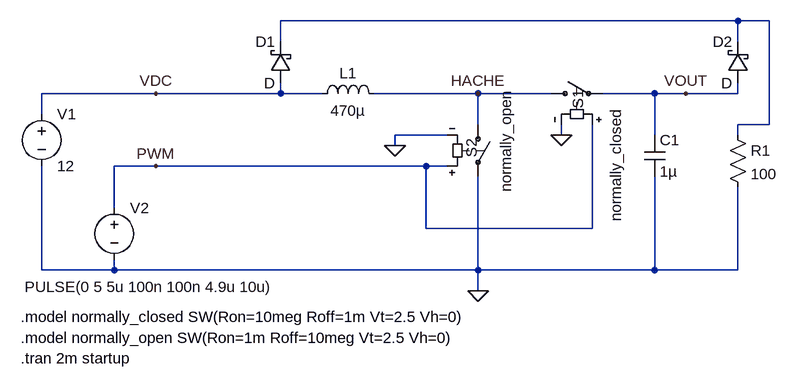
[diagram p0: schematic elevateur_parfait Diode schottky alims test 2.asc]
elevateur_parfait Diode schottky alims test 2.asc, the LTspice schematic file:
Version 4
SHEET 1 880 680
WIRE 416 0 -288 0
WIRE 464 0 416 0
WIRE -288 32 -288 0
WIRE 416 32 416 0
WIRE -480 112 -656 112
WIRE -288 112 -288 96
WIRE -288 112 -480 112
WIRE -224 112 -288 112
WIRE 16 112 -144 112
WIRE 128 112 16 112
WIRE 288 112 208 112
WIRE 336 112 288 112
WIRE 416 112 416 96
WIRE 416 112 336 112
WIRE -656 144 -656 112
WIRE 16 160 16 112
WIRE 464 160 464 0
WIRE 464 160 416 160
WIRE -32 176 -112 176
WIRE 144 176 144 160
WIRE 288 176 288 112
WIRE 416 176 416 160
WIRE -112 192 -112 176
WIRE -480 224 -544 224
WIRE -64 224 -480 224
WIRE -32 224 -64 224
WIRE -544 288 -544 224
WIRE -64 320 -64 224
WIRE 192 320 192 160
WIRE 192 320 -64 320
WIRE -656 384 -656 224
WIRE -544 384 -544 368
WIRE -544 384 -656 384
WIRE 16 384 16 240
WIRE 16 384 -544 384
WIRE 288 384 288 240
WIRE 288 384 16 384
WIRE 416 384 416 256
WIRE 416 384 288 384
WIRE 16 416 16 384
FLAG 16 416 0
FLAG -480 112 VDC
FLAG 336 112 VOUT
FLAG 16 112 HACHE
FLAG -480 224 PWM
FLAG -112 192 0
FLAG 144 176 0
SYMBOL ind -240 128 R270
WINDOW 0 32 56 VTop 2
WINDOW 3 5 56 VBottom 2
SYMATTR InstName L1
SYMATTR Value 470µ
SYMBOL res 400 160 R0
SYMATTR InstName R1
SYMATTR Value 100
SYMBOL cap 272 176 R0
SYMATTR InstName C1
SYMATTR Value 1µ
SYMBOL sw 112 112 R270
WINDOW 38 -197 116 Left 2
WINDOW 0 -23 58 Left 2
SYMATTR SpiceModel normally_closed
SYMATTR InstName S1
SYMATTR Value ""
SYMBOL sw 16 144 R0
WINDOW 38 43 -39 VRight 2
WINDOW 0 -10 67 VLeft 2
SYMATTR SpiceModel normally_open
SYMATTR InstName S2
SYMATTR Value ""
SYMBOL voltage -656 128 R0
WINDOW 123 0 0 Left 2
WINDOW 39 0 0 Left 2
SYMATTR InstName V1
SYMATTR Value 12
SYMBOL voltage -544 272 R0
WINDOW 3 -138 138 Left 2
WINDOW 123 0 0 Left 2
WINDOW 39 0 0 Left 2
SYMATTR Value PULSE(0 5 5u 100n 100n 4.9u 10u)
SYMATTR InstName V2
SYMBOL schottky -272 96 R180
WINDOW 0 24 64 Left 2
WINDOW 3 24 0 Left 2
SYMATTR InstName D1
SYMBOL schottky 432 96 R180
WINDOW 0 24 64 Left 2
WINDOW 3 24 0 Left 2
SYMATTR InstName D2
TEXT -688 456 Left 2 !.model normally_closed SW(Ron=10meg Roff=1m Vt=2.5 Vh=0)
TEXT -688 520 Left 2 !.tran 2m startup
TEXT -688 488 Left 2 !.model normally_open SW(Ron=1m Roff=10meg Vt=2.5 Vh=0)

The netlist it stands for:
* elevateur_parfait Diode schottky alims test 2.asc
L1 VDC HACHE 470µ
R1 N001 0 100
C1 VOUT 0 1µ
S1 HACHE VOUT PWM 0 normally_closed
S2 HACHE 0 PWM 0 normally_open
V1 VDC 0 12
V2 PWM 0 PULSE(0 5 5u 100n 100n 4.9u 10u)
D1 VDC N001 D
D2 VOUT N001 D
.model D D
.lib standard.dio
.model normally_closed SW(Ron=10meg Roff=1m Vt=2.5 Vh=0)
.tran 2m startup
.model normally_open SW(Ron=1m Roff=10meg Vt=2.5 Vh=0)
.backanno
.end